# Altium schematic sheet voltage_channel.SchDoc: Voltage Channel
size A4; DrawnBy: Stefan Lippuner; Organization: TIK; DocumentNumber: 6; Revision: 2; SheetNumber: 6; SheetTotal: 8
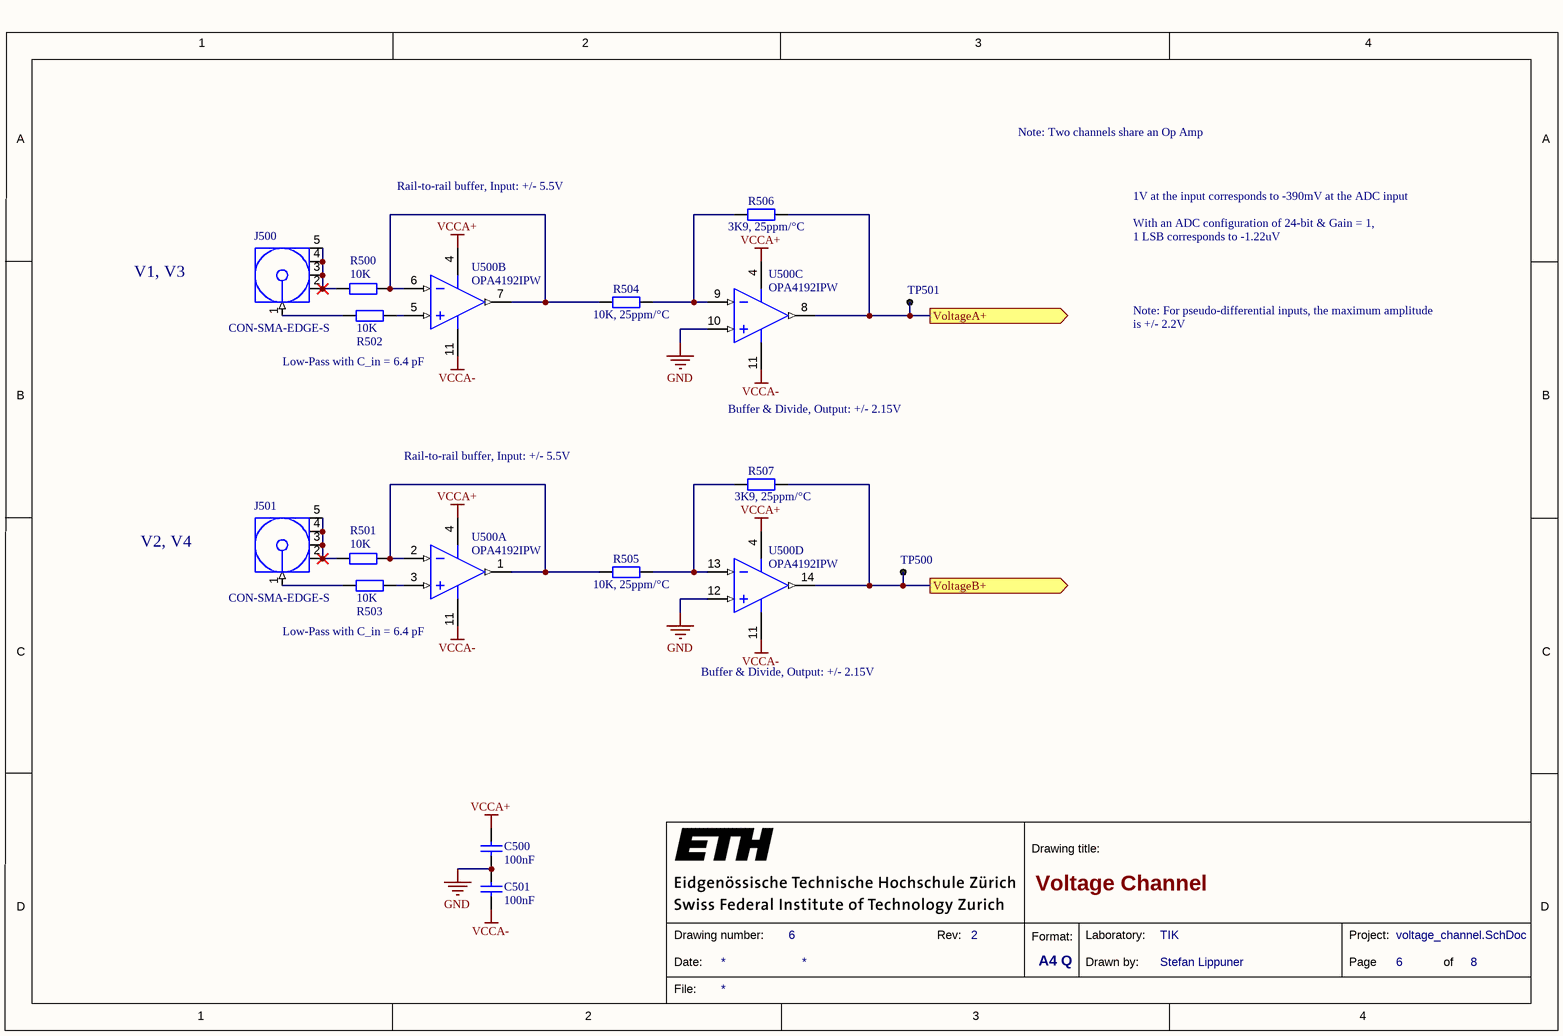
[diagram p0: voltage_channel.SchDoc]

## Parts
(Parts that share a designator on the sheet are numbered #1, #2 ... from top to bottom, then left to right.)
C500  100nF  [CAPC0402(1005)60_L]
C501  100nF  [CAPC0402(1005)60_L]
J500  CON-SMA-EDGE-S  [132322]
J501  CON-SMA-EDGE-S  [132322]
R500  10K  [RESC0402(1005)_L]
R501  10K  [RESC0402(1005)_L]
R502  10K  [RESC0402(1005)_L]
R503  10K  [RESC0402(1005)_L]
R504  10K, 25ppm/°C  [RESC0402(1005)_L]
R505  10K, 25ppm/°C  [RESC0402(1005)_L]
R506  3K9, 25ppm/°C  [RESC0402(1005)_L]
R507  3K9, 25ppm/°C  [RESC0402(1005)_L]
TP500  (no value)  [Pad-0.6mm]  (no BOM)
TP501  (no value)  [Pad-0.6mm]  (no BOM)
U500#1  OPA4192IPW  [TSSOP-ST14_L]  (parts A,B of 4)
U500#2  OPA4192IPW  [TSSOP-ST14_L]  (parts C,D of 4)

## Ports
VoltageA+ (out), VoltageB+ (out)

## Nets
GND: C500.1 C501.2 U500#2.10(VINC+) U500#2.12(VIND+)
VCCA+: C500.2 U500#1.4(VDD) U500#2.4(VDD)
VCCA-: C501.1 U500#1.11(VSS) U500#2.11(VSS)
VoltageA+: R506.2 TP501.1 U500#2.8(VOUTC) ; port VoltageA+
VoltageB+: R507.2 TP500.1 U500#2.14(VOUTD) ; port VoltageB+
NetJ500_1: J500.1(Signal) R502.2
NetJ500_2: J500.2(GND) J500.3(GND) J500.4(GND) J500.5(GND) R500.2
NetJ501_1: J501.1(Signal) R503.2
NetJ501_2: J501.2(GND) J501.3(GND) J501.4(GND) J501.5(GND) R501.2
NetR500_1: R500.1 R504.2 U500#1.6(VINB-) U500#1.7(VOUTB)
NetR501_1: R501.1 R505.2 U500#1.1(VOUTA) U500#1.2(VINA-)
NetR502_1: R502.1 U500#1.5(VINB+)
NetR503_1: R503.1 U500#1.3(VINA+)
NetR504_1: R504.1 R506.1 U500#2.9(VINC-)
NetR505_1: R505.1 R507.1 U500#2.13(VIND-)

## Notes on the sheet
- Note: Two channels share an Op Amp
- Rail-to-rail buffer, Input: +/- 5.5V
- 1V at the input corresponds to -390mV at the ADC input
  With an ADC configuration of 24-bit & Gain = 1,
  1 LSB corresponds to -1.22uV
- V1, V3
- Low-Pass with C_in = 6.4 pF
- Note: For pseudo-differential inputs, the maximum amplitude is +/- 2.2V
- Buffer & Divide, Output: +/- 2.15V
- V2, V4
- 1
- 2
- 3
- 4
- A
- B
- C
- Drawing title:
- D
- Date:
- Drawing number:
- Rev:
- Format:
- A4 Q
- Drawn by:
- Laboratory:
- Page
- Project:
- of
- File:

## Library data of the parts
C500 C501 = CMP-1034-02071-1: CAP 100nF 16V -20% to +80% 0402 (1005 Metric) Thickness 0.6mm SMD; Case-Metric: 1005; Case-EIA: 0402; Value: 100nF; Rated Voltage: 16 V; Tolerance: -20% to +80%; Technology: SMT; Max Thickness: 0.6 mm
J500 J501 = CMP-00231-1: SMA FEMALE PCB EDGE MOUNT; Manufacturer: RF Solutions; Connector Type: Jack, Female Socket; Contact Termination: Solder; Packaging: -; Part Status: Active; Connector Style: SMA; Shield Termination: Solder; Impedance: -; Mounting Type: Board Edge, End Launch; Cable Group: -; Fastening Type: Threaded; Frequency - Max: -; Features: -; Housing Color: -; Ingress Protection: -; Body Material: -; Body Finish: -; Center Contact Material: -; Center Contact Plating: -; Dielectric Material: -; Voltage Rating: -; Operating Temperature: -; Manufacturer Part Number: CON-SMA-EDGE-S; Supplier: Digi-Key; Supplier Part Number: CON-SMA-EDGE-S-ND
R500-R503 = CMP-1011-00623-1: 10K 0.063W 1% 0402 (1005 Metric)  SMD; Case-Metric: 1005; Value: 10000.00 Ohm; Case-EIA: 0402; Tolerance: 1 %; Technology: SMT; Power: 0.063 W
R504 R505 = CMP-1591-00004-1: 10K, 25ppm/°C 0402 (1005 Metric) Chip Resistor; Case-Metric: 1005; Case-EIA: 0402; PackageReference: RESC0402(1005); Supplier 1: Digi-Key; Supplier Part Number 1: RR05P10.0KDDKR-ND
R506 R507 = CMP-1591-00004-1: 3K9, 25ppm/°C, 0402 (1005 Metric) Chip Resistor; Case-EIA: 0402; Case-Metric: 1005; PackageReference: RESC0402(1005); Supplier 1: Digi-Key; Supplier Part Number 1: RR05P3.9KDCT-ND
TP500 TP501 = CMP-00224-2: 0.6mm SMT Test Pad; Mounting Technology: SMT
U500#1 U500#2 = CMP-00106-1: Precision, Rail-to-Rail Input/Output, Low Offset Voltage, Low Input Bias Current Op Amp with e-trim; Manufacturer: Texas Instruments; Amplifier Type: General Purpose; Number of Circuits: 1; Slew Rate: 20 V/µs; Gain Bandwidth Product: 10MHz; Current - Input Bias: 5pA; Voltage - Input Offset: 5µV; Current - Supply: 1mA; Current - Output / Channel: 65mA; Voltage - Supply, Single/Dual (±): 4.5 V ~ 36 V, ±2.25 V ~ 18 V; Packaging: Tube; Output Type: Rail-to-Rail; -3db Bandwidth: -; Operating Temperature: -40°C ~ 125°C; Mounting Type: Surface Mount; Package / Case: 14-TSSOP (0.173", 4.40mm Width); Supplier Device Package: 14-TSSOP; P/N: OPA4192IPW; Supplier: Digi-Key; Supplier Part Number: 296-43691-ND; ComponentLink1Description: opa4192.pdf; ComponentLink1URL: http://www.ti.com/lit/ds/symlink/opa4192.pdf